# Altium schematic sheet Arduino_mini.SchDoc
size Letter; CompanyName: Carnegie Mellon University; Organization: Carnegie Mellon University; Address1: Carnegie Mellon University; Address2: Robotics Institute; Address3: 5000 Forbes Ave., 4208 NSH; Address4: Pittsburgh, PA 15213; DocumentNumber: 2; Revision: 1.0; SheetNumber: 2; SheetTotal: 8; PageSetup: Record=PageOptions|CenterHorizontal=True|CenterVertical=True|PrintScale=1.00|XCorrection=1.00|YCorrection=1.00|PrintKind=0|BorderSize=5000000|LeftOffset=0|BottomOffset=0|Orientation=2|PaperLength=1000|PaperWidth=1000|Scale=100|PaperSource=7|PrintQuality=-4|MediaType=1|DitherType=10|PaperKind=Letter|PrintScaleMode=1
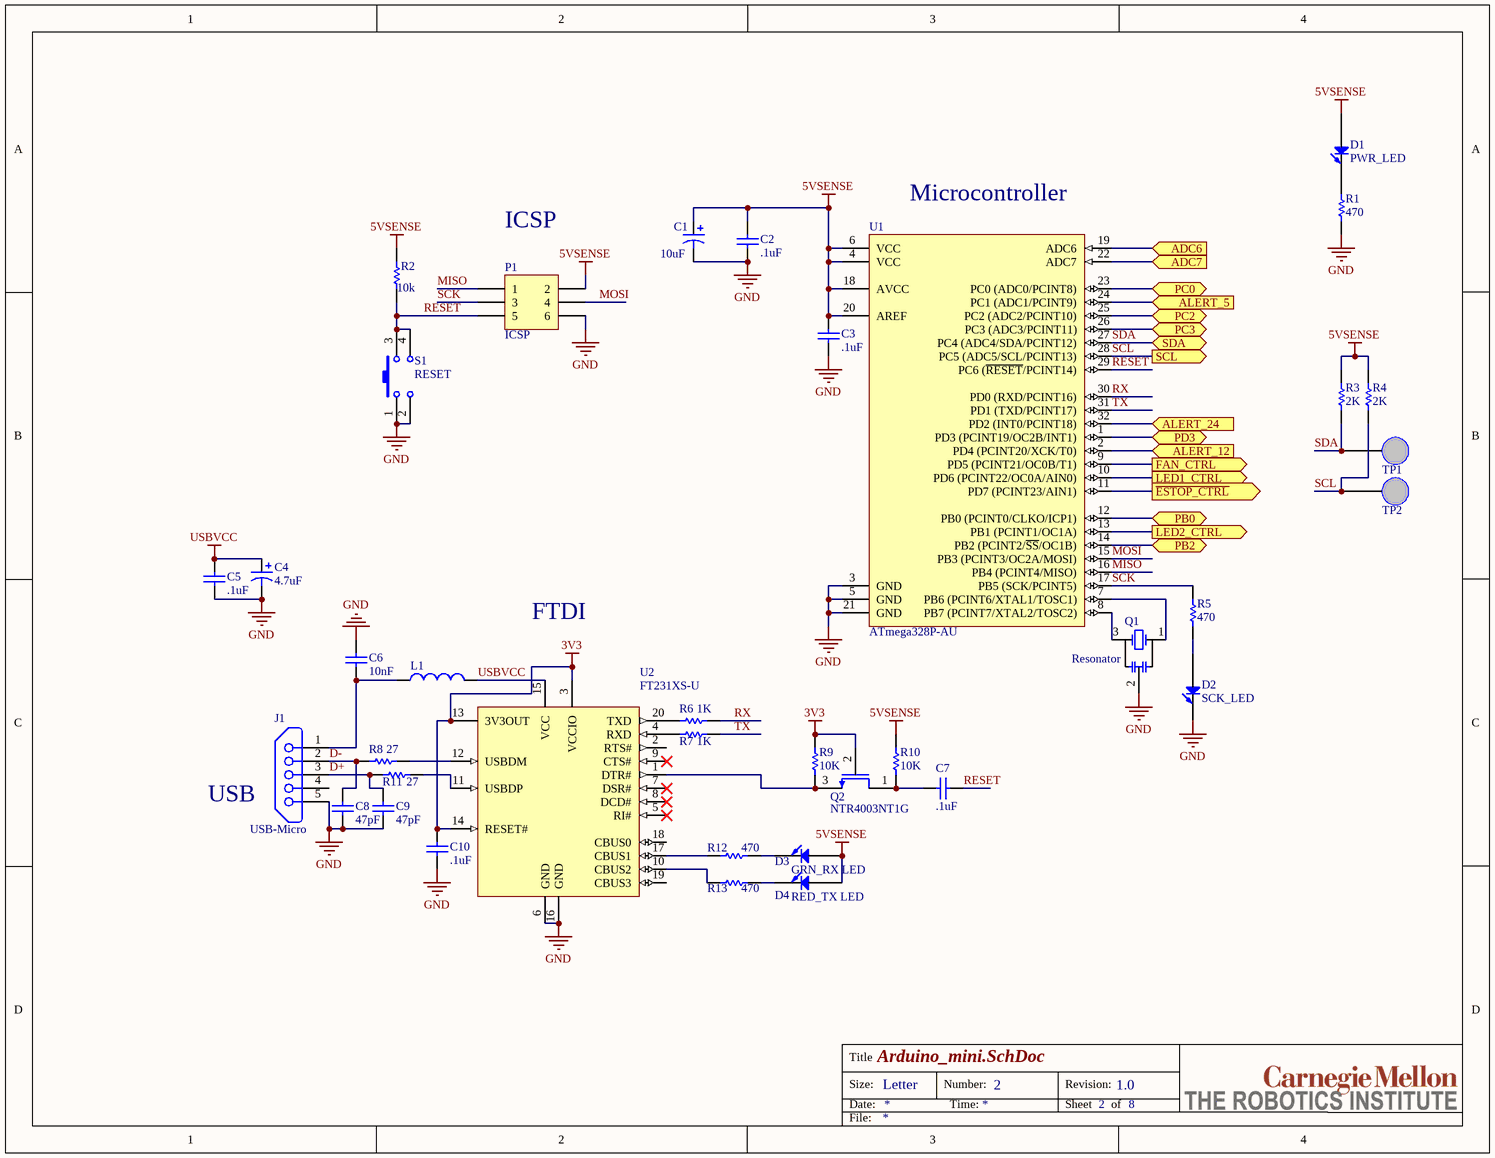
[diagram p0: Arduino_mini.SchDoc]

## Parts
C1  value 10uF  [CAPC2012N]  (hidden comment: Bypass Tantalum, 5V, 10uF)
C2  value .1uF  [CAPC1608N]  (hidden comment: Bypass, 5V, 0.1uF)
C3  value .1uF  [CAPC1608N]  (hidden comment: Bypass, 5V, .1uF)
C4  value 4.7uF  [CAPC2012N]  (hidden comment: Bypass Tantalum, USB_PWR, 4.7uF)
C5  value .1uF  [CAPC1608N]  (hidden comment: Bypass, USB_PWR, .1uF)
C6  value 10nF  [CAPC1608N]  (hidden comment: Bypass, USB_PWR, 10nF)
C7  .1uF  [CAPC1608N]
C8  47pF  [CAPC1608N]
C9  47pF  [CAPC1608N]
C10  value .1uF  [CAPC1608N]  (hidden comment: Bypass, 3V3, .1uF)
D1  PWR_LED  [0603 - LED]
D2  SCK_LED  [0603 - LED]
D3  GRN_RX LED  [0603 - LED]
D4  RED_TX LED  [0603 - LED]
J1  USB-Micro  [USB-Micro Type B]
L1  Ferrite Bead, USB_PWR  [INDC2012N]  (value not drawn)
P1  ICSP  [MHDR2X3-LOCK]
Q1  Resonator  [Resonator]
Q2  NTR4003NT1G  [SOT-23]
R1  470  [RESC1608N]
R2  10k  [RESC1608N]
R3  2K  [RESC1608N]
R4  2K  [RESC1608N]
R5  470  [RESC1608N]
R6  1K  [RESC1608N]
R7  1K  [RESC1608N]
R8  27  [RESC1608N]
R9  10K  [RESC1608N]
R10  10K  [RESC1608N]
R11  27  [RESC1608N]
R12  470  [RESC1608N]
R13  470  [RESC1608N]
S1  RESET  [PushBtn-Tiny]
TP1  SDA  [TestPoint]  (value not drawn)
TP2  SCL  [TestPoint]  (value not drawn)
U1  ATmega328P-AU  [32A_M]
U2  FT231XS-U  [SSOP-20_N]

## Ports
ADC6 (in), ADC7 (in), ALERT_5 (in), ALERT_12 (in), ALERT_24 (in), FAN_CTRL (out), LED1_CTRL (out), LED2_CTRL (out), PB0 (bidir), PB2 (bidir), PC0 (bidir), PC2 (bidir), PC3 (bidir), PD3 (bidir), SCL (out), SDA (bidir), ~{ESTOP_CTRL} (out)

## Nets
3V3: C10.2 Q2.2 R9.2 U2.3(VCCIO) U2.13(3V3OUT) U2.14(RESET#)
5VSENSE: C1.1 C2.1 C3.1 D1.2(A) D3.2(A) D4.2(A) P1.2 R2.2 R3.2 R4.2 R10.2 U1.4(VCC) U1.6(VCC) U1.18(AVCC) U1.20(AREF)
GND: C1.2 C2.2 C3.2 C4.2 C5.2 C6.2 C8.1 C9.1 C10.1 D2.1(K) J1.5(GND) P1.6 Q1.2(GND) R1.1 S1.1 S1.2 U1.3(GND) U1.5(GND) U1.21(GND) U2.6(GND) U2.16(GND)
USBVCC: C4.1 C5.1 L1.2 U2.15(VCC)
ADC6: U1.19(ADC6) ; port ADC6
ADC7: U1.22(ADC7) ; port ADC7
ALERT_5: U1.24(PC1_(ADC1/PCINT9)) ; port ALERT_5
ALERT_12: U1.2(PD4_(PCINT20/XCK/T0)) ; port ALERT_12
ALERT_24: U1.32(PD2_(INT0/PCINT18)) ; port ALERT_24
D+: C9.2 J1.3(D+) R11.2
D-: C8.2 J1.2(D-) R8.2
~{ESTOP_CTRL}: U1.11(PD7_(PCINT23/AIN1)) ; port ~{ESTOP_CTRL}
FAN_CTRL: U1.9(PD5_(PCINT21/OC0B/T1)) ; port FAN_CTRL
LED1_CTRL: U1.10(PD6_(PCINT22/OC0A/AIN0)) ; port LED1_CTRL
LED2_CTRL: U1.13(PB1_(PCINT1/OC1A)) ; port LED2_CTRL
MISO: P1.1 U1.16(PB4_(PCINT4/MISO))
MOSI: P1.4 U1.15(PB3_(PCINT3/OC2A/MOSI))
PB0: U1.12(PB0_(PCINT0/CLKO/ICP1)) ; port PB0
PB2: U1.14(PB2_(PCINT2/~{SS}/OC1B)) ; port PB2
PC0: U1.23(PC0_(ADC0/PCINT8)) ; port PC0
PC2: U1.25(PC2_(ADC2/PCINT10)) ; port PC2
PC3: U1.26(PC3_(ADC3/PCINT11)) ; port PC3
PD3: U1.1(PD3_(PCINT19/OC2B/INT1)) ; port PD3
RESET: C7.2 P1.5 R2.1 S1.3 S1.4 U1.29(PC6_(~{RESET}/PCINT14))
RX: R6.1 U1.30(PD0_(RXD/PCINT16))
SCK: P1.3 R5.2 U1.17(PB5_(SCK/PCINT5))
SCL: R4.1 TP2.1 U1.28(PC5_(ADC5/SCL/PCINT13)) ; port SCL
SDA: R3.1 TP1.1 U1.27(PC4_(ADC4/SDA/PCINT12)) ; port SDA
TX: R7.1 U1.31(PD1_(TXD/PCINT17))
NetC6_1: C6.1 J1.1(V_BUS) L1.1
NetC7_1: C7.1 Q2.1 R10.1
NetD1_1: D1.1(K) R1.2
NetD2_2: D2.2(A) R5.1
NetD3_1: D3.1(K) R12.1
NetD4_1: D4.1(K) R13.1
NetQ1_1: Q1.1(OSC1) U1.7(PB6_(PCINT6/XTAL1/TOSC1))
NetQ1_3: Q1.3(OSC2) U1.8(PB7_(PCINT7/XTAL2/TOSC2))
NetQ2_3: Q2.3 R9.1 U2.1(DTR#)
NetR6_2: R6.2 U2.20(TXD)
NetR7_2: R7.2 U2.4(RXD)
NetR8_1: R8.1 U2.12(USBDM)
NetR11_1: R11.1 U2.11(USBDP)
NetR12_2: R12.2 U2.17(CBUS1)
NetR13_2: R13.2 U2.10(CBUS2)

Not connected (* = marked no-connect by the designer): J1 4(ID); U2 2(RTS#) 5(RI#)* 7(DSR#)* 8(DCD#)* 9(CTS#)* 18(CBUS0) 19(CBUS3)

## Notes on the sheet
- ICSP
- (near U1) Microcontroller
- FTDI
- USB
- Title
- Size:
- Date:
- Letter
- Number:
- Time:
- Revision:
- Sheet
- of
- File:

## Library data of the parts
C1 = Cap Pol1: Polarized Capacitor (Radial); Manufacturer: AVX Corporation; Manufacturer Part Number: TACL106M010RTA; Manufacturer Size Code: L; Capacitance: 10µF; Tolerance: ±20%; Voltage - Rated: 10V; ESR (Equivalent Series Resistance): 7.5 Ohm; Type: Molded; Description: CAP TANT 10UF 6.3V 20% 0805; Published: 8-Jun-2000; LatestRevisionDate: 17-Jul-2002; LatestRevisionNote: Re-released for DXP Platform.; PackageReference: RB7.6-15; Publisher: Altium Limited; PackageDescription: Polarized Capacitor (Radial); 2 Leads; Supplier 1: Digi-Key; Supplier Part Number 1: 478-6230-1-ND; RoHS: RoHS Compliant; Category: Capacitors; Stock 1: 13074; Pricing 1: 1=2.24, 10=1.836, 100=1.2983, 250=1.07448, 500=0.96256, 1000=0.8954 (USD); Packaging: Cut Tape (CT); Operating Temperature: -55°C ~ 125°C; Mounting Type: Surface Mount; Package / Case: 0603 (1608 Metric); Size / Dimension: 0.063" L x 0.033" W (1.60mm x 0.85mm); Height - Seated (Max): 0.039" (1.00mm); Lead Spacing: -; Features: General Purpose; Lifetime @ Temp.: -; ComponentLink1URL: http://datasheets.avx.com/TAC.pdf; ComponentLink1Description: http://datasheets.avx.com/TAC.pdf; Supplier 2: Digi-Key; Supplier Part Number 2: 478-8115-1-ND; Stock 2: 38138; Pricing 2: 1=0.37, 10=0.312, 100=0.156, 250=0.117, 500=0.10336, 1000=0.09165 (USD); ComponentLink2URL: http://datasheets.avx.com/f92.pdf; ComponentLink2Description: http://datasheets.avx.com/f92.pdf
C2 C3 C5 C7 C10 = Cap Semi: Capacitor (Semiconductor SIM Model); Manufacturer: Murata Electronics North America; Manufacturer Part Number: GRM188R71C104KA01D; Capacitance: 0.1µF; Tolerance: ±10%; Voltage - Rated: 16V; Temperature Coefficient: X7R; Description: CAP CER 0.1UF 50V X7R 0603; Published: 8-Jun-2000; LatestRevisionDate: 29-May-2009; LatestRevisionNote: IPC-7351 Footprint Added.; PackageReference: C1206; Publisher: Altium Limited; PackageDescription: Chip Capacitor; Supplier 1: Digi-Key; Supplier Part Number 1: 490-1532-1-ND; RoHS: RoHS Compliant; Category: Capacitors; Stock 1: 4374431; Pricing 1: 1=0.1, 10=0.019, 50=0.0102, 100=0.0086, 250=0.00704, 500=0.006, 1000=0.00468 (USD); Packaging: Cut Tape (CT); Mounting Type: Surface Mount, MLCC; Operating Temperature: -55°C ~ 125°C; Applications: General Purpose; Ratings: -; Package / Case: 0603 (1608 Metric); Size / Dimension: 0.063" L x 0.031" W (1.60mm x 0.80mm); Height - Seated (Max): -; Thickness (Max): 0.035" (0.90mm); Lead Spacing: -; Features: -; Lead Style: -; ComponentLink1URL: http://www.murata.com/~/media/webrenewal/support/library/catalog/products/capacitor/mlcc/c02e.ashx; ComponentLink1Description: http://www.murata.com/~/media/webrenewal/support/library/catalog/products/capacitor/mlcc/c02e.ashx; Supplier 2: Digi-Key; Supplier Part Number 2: 490-13406-1-ND; Stock 2: 7465; Pricing 2: 1=0.11, 10=0.078, 50=0.0422, 100=0.0358, 250=0.02924, 500=0.02502, 1000=0.0195 (USD); ComponentLink2URL: http://www.murata.com/~/media/webrenewal/support/library/catalog/products/capacitor/mlcc/c02e.pdf; ComponentLink2Description: http://www.murata.com/~/media/webrenewal/support/library/catalog/products/capacitor/mlcc/c02e.pdf
  C7: Value: .1uF
C4 = Cap Pol1: Polarized Capacitor (Radial); Manufacturer: AVX Corporation; Manufacturer Part Number: TACL106M010RTA; Manufacturer Size Code: L; Capacitance: 10µF; Tolerance: ±20%; Voltage - Rated: 10V; ESR (Equivalent Series Resistance): 7.5 Ohm; Type: Molded; Description: CAP TANT 4.7UF 6.3V 20% 0805; Published: 8-Jun-2000; LatestRevisionDate: 17-Jul-2002; LatestRevisionNote: Re-released for DXP Platform.; PackageReference: RB7.6-15; Publisher: Altium Limited; PackageDescription: Polarized Capacitor (Radial); 2 Leads; Supplier 1: Digi-Key; Supplier Part Number 1: 478-6230-1-ND; RoHS: RoHS Compliant; Category: Capacitors; Stock 1: 13074; Pricing 1: 1=2.24, 10=1.836, 100=1.2983, 250=1.07448, 500=0.96256, 1000=0.8954 (USD); Packaging: Cut Tape (CT); Operating Temperature: -55°C ~ 125°C; Mounting Type: Surface Mount; Package / Case: 0603 (1608 Metric); Size / Dimension: 0.063" L x 0.033" W (1.60mm x 0.85mm); Height - Seated (Max): 0.039" (1.00mm); Lead Spacing: -; Features: General Purpose; Lifetime @ Temp.: -; ComponentLink1URL: http://datasheets.avx.com/TAC.pdf; ComponentLink1Description: http://datasheets.avx.com/TAC.pdf; Supplier 2: Digi-Key; Supplier Part Number 2: 478-8120-1-ND; Stock 2: 11892; Pricing 2: 1=0.32, 10=0.284, 100=0.1418, 250=0.1134, 500=0.10328, 1000=0.09315 (USD); ComponentLink2URL: http://datasheets.avx.com/f92.pdf; ComponentLink2Description: http://datasheets.avx.com/f92.pdf
C6 = Cap Semi: Capacitor (Semiconductor SIM Model); Manufacturer: Murata Electronics North America; Manufacturer Part Number: GRM188R71C104KA01D; Capacitance: 0.1µF; Tolerance: ±10%; Voltage - Rated: 16V; Temperature Coefficient: X7R; Description: CAP CER 10000PF 50V X7R 0603; Published: 8-Jun-2000; LatestRevisionDate: 29-May-2009; LatestRevisionNote: IPC-7351 Footprint Added.; PackageReference: C1206; Publisher: Altium Limited; PackageDescription: Chip Capacitor; Supplier 1: Digi-Key; Supplier Part Number 1: 490-1532-1-ND; RoHS: RoHS Compliant; Category: Capacitors; Stock 1: 4374431; Pricing 1: 1=0.1, 10=0.019, 50=0.0102, 100=0.0086, 250=0.00704, 500=0.006, 1000=0.00468 (USD); Packaging: Cut Tape (CT); Mounting Type: Surface Mount, MLCC; Operating Temperature: -55°C ~ 125°C; Applications: General Purpose; Ratings: -; Package / Case: 0603 (1608 Metric); Size / Dimension: 0.063" L x 0.031" W (1.60mm x 0.80mm); Height - Seated (Max): -; Thickness (Max): 0.035" (0.90mm); Lead Spacing: -; Features: -; Lead Style: -; ComponentLink1URL: http://www.murata.com/~/media/webrenewal/support/library/catalog/products/capacitor/mlcc/c02e.ashx; ComponentLink1Description: http://www.murata.com/~/media/webrenewal/support/library/catalog/products/capacitor/mlcc/c02e.ashx; Supplier 2: Digi-Key; Supplier Part Number 2: 490-1512-1-ND; Stock 2: 1780213; Pricing 2: 1=0.1, 10=0.019, 50=0.01, 100=0.0085, 250=0.00696, 500=0.00596, 1000=0.00465 (USD); ComponentLink2URL: http://www.murata.com/~/media/webrenewal/support/library/catalog/products/capacitor/mlcc/c02e.pdf; ComponentLink2Description: http://www.murata.com/~/media/webrenewal/support/library/catalog/products/capacitor/mlcc/c02e.pdf
C8 C9 = Cap Semi: Capacitor (Semiconductor SIM Model); Manufacturer: Murata Electronics North America; Manufacturer Part Number: GRM188R71C104KA01D; Capacitance: 0.1µF; Tolerance: ±10%; Voltage - Rated: 16V; Temperature Coefficient: X7R; Description: CAP CER 47PF 50V NP0 0603; Published: 8-Jun-2000; LatestRevisionDate: 29-May-2009; LatestRevisionNote: IPC-7351 Footprint Added.; PackageReference: C1206; Publisher: Altium Limited; PackageDescription: Chip Capacitor; Value: 47pF; Supplier 1: Digi-Key; Supplier Part Number 1: 490-1532-1-ND; RoHS: RoHS Compliant; Category: Capacitors; Stock 1: 4374431; Pricing 1: 1=0.1, 10=0.019, 50=0.0102, 100=0.0086, 250=0.00704, 500=0.006, 1000=0.00468 (USD); Packaging: Cut Tape (CT); Mounting Type: Surface Mount, MLCC; Operating Temperature: -55°C ~ 125°C; Applications: General Purpose; Ratings: -; Package / Case: 0603 (1608 Metric); Size / Dimension: 0.063" L x 0.031" W (1.60mm x 0.80mm); Height - Seated (Max): -; Thickness (Max): 0.035" (0.90mm); Lead Spacing: -; Features: -; Lead Style: -; ComponentLink1URL: http://www.murata.com/~/media/webrenewal/support/library/catalog/products/capacitor/mlcc/c02e.ashx; ComponentLink1Description: http://www.murata.com/~/media/webrenewal/support/library/catalog/products/capacitor/mlcc/c02e.ashx; Supplier 2: Digi-Key; Supplier Part Number 2: 1276-1037-1-ND; Stock 2: 267726; Pricing 2: 1=0.1, 10=0.027, 25=0.0192, 50=0.0148, 100=0.0125, 500=0.00878, 1000=0.00684 (USD); ComponentLink2URL: http://www.samsungsem.com/kr/support/product-search/mlcc/CL10C470JB8NNNC.jsp; ComponentLink2Description: http://www.samsungsem.com/kr/support/product-search/mlcc/CL10C470JB8NNNC.jsp
D1 = LED0: Green LED; Manufacturer: Lite-On Inc.; Manufacturer Part Number: LTST-C191TGKT; Lens Color: Colorless; Lens Transparency: Clear; Millicandela Rating: 260.5mcd; Lens Style/Size: Rectangle with Flat Top, 1.10mm x 0.80mm; Voltage - Forward (Vf) (Typ): 3.2V; Current - Test: 20mA; Viewing Angle: 130°; Wavelength - Dominant: 525nm; Wavelength - Peak: 530nm; Description: LED YELLOW CLEAR 0603 SMD; Supplier 1: Digi-Key; Supplier Part Number 1: 160-1888-1-ND; RoHS: RoHS Compliant; Category: Optoelectronics; Stock 1: 25596; Pricing 1: 1=0.57, 10=0.436, 100=0.2828, 250=0.2424, 500=0.21008, 1000=0.1616, 2500=0.14544 (USD); Packaging: Cut Tape (CT); Color: Green; Mounting Type: Surface Mount; Features: -; Package / Case: 0603 (1608 Metric); Supplier Device Package: *; Size / Dimension: 1.60mm L x 0.80mm W; Height (Max): 0.55mm; ComponentLink1URL: http://optoelectronics.liteon.com/upload/download/DS22-2000-300/S_110_LTST-C191TGKT.pdf; ComponentLink1Description: http://optoelectronics.liteon.com/upload/download/DS22-2000-300/S_110_LTST-C191TGKT.pdf; Supplier 2: Digi-Key; Supplier Part Number 2: 160-1448-1-ND; Stock 2: 378240; Pricing 2: 1=0.31, 10=0.225, 25=0.1656, 100=0.1183, 250=0.0804, 500=0.07096, 1000=0.05558, 2500=0.0544 (USD); ComponentLink2URL: http://optoelectronics.liteon.com/upload/download/DS22-2000-224/S_110_LTST-C191KSKT.pdf; ComponentLink2Description: http://optoelectronics.liteon.com/upload/download/DS22-2000-224/S_110_LTST-C191KSKT.pdf
D2 = LED0: Green LED; Manufacturer: Lite-On Inc.; Manufacturer Part Number: LTST-C191TBKT; Color: Blue; Lens Color: Colorless; Lens Transparency: Clear; Millicandela Rating: 104mcd; Lens Style/Size: Rectangle with Flat Top, 1.10mm x 0.80mm; Voltage - Forward (Vf) (Typ): 3.3V; Current - Test: 20mA; Viewing Angle: 130°; Wavelength - Dominant: 470nm; Wavelength - Peak: 468nm; Description: LED BLUE CLEAR 0603 SMD; Supplier 1: Digi-Key; Supplier Part Number 1: 160-1647-1-ND; RoHS: RoHS Compliant; Category: Optoelectronics; Stock 1: 56077; Pricing 1: 1=0.52, 10=0.376, 25=0.2884, 100=0.1881, 250=0.13796, 500=0.11704, 1000=0.09614, 2500=0.0836 (USD); Packaging: Cut Tape (CT); Mounting Type: Surface Mount; Features: -; Package / Case: 0603 (1608 Metric); Supplier Device Package: *; Size / Dimension: 1.60mm L x 0.80mm W; Height (Max): 0.55mm; ComponentLink1URL: http://optoelectronics.liteon.com/upload/download/DS22-2000-230/S_110_LTST-C191TBKT.pdf; ComponentLink1Description: http://optoelectronics.liteon.com/upload/download/DS22-2000-230/S_110_LTST-C191TBKT.pdf
D3 = LED0: Green LED; Manufacturer: Lite-On Inc; Manufacturer Part Number: LTST-C191TGKT; Wavelength - Dominant: 525nm; Wavelength - Peak: 530nm; Millicandela Rating: 260.5mcd; Voltage - Forward (Vf) (Typ): 3.2V; Current - Test: 20mA; Viewing Angle: 130°; Lens Transparency: Clear; Lens Color: Colorless; Lens Style/Size: Rectangle with Flat Top, 1.10mm x 0.80mm; Description: LED GREEN CLEAR 0603 SMD; Published: 8-Jun-2000; LatestRevisionDate: 08-Jul-2005; LatestRevisionNote: Mech Layer 1 removed.; PackageReference: LED-0; Publisher: Altium Limited; PackageDescription: LED; 2 Leads; Supplier 1: Digi-Key; Supplier Part Number 1: 160-1888-1-ND; RoHS: RoHS Compliant; Category: Optoelectronics; Stock 1: 56679; Pricing 1: 1=0.6, 10=0.436, 25=0.3556, 100=0.2844, 250=0.23996, 500=0.20442, 1000=0.15998, 2500=0.14665 (USD); Packaging: Cut Tape (CT); Color: Green; Package / Case: 0603 (1608 Metric); Supplier Device Package: *; Size / Dimension: 1.60mm L x 0.80mm W; Height (Max): 0.55mm; Mounting Type: Surface Mount; ComponentLink1URL: http://optoelectronics.liteon.com/upload/download/DS22-2000-300/S_110_LTST-C191TGKT.pdf; ComponentLink1Description: http://optoelectronics.liteon.com/upload/download/DS22-2000-300/S_110_LTST-C191TGKT.pdf; Features: -
D4 = LED0: led; Manufacturer: Lite-On Inc; Manufacturer Part Number: LTST-C191KRKT; Color: Red; Wavelength - Dominant: 631nm; Wavelength - Peak: 639nm; Millicandela Rating: 54mcd; Voltage - Forward (Vf) (Typ): 2V; Current - Test: 20mA; Viewing Angle: 130°; Lens Transparency: Clear; Lens Color: Colorless; Lens Style/Size: Rectangle with Flat Top, 1.10mm x 0.80mm; Description: LED RED CLEAR 0603 SMD; Published: 8-Jun-2000; LatestRevisionDate: 08-Jul-2005; LatestRevisionNote: Mech Layer 1 removed.; PackageReference: LED-0; Publisher: Altium Limited; PackageDescription: LED; 2 Leads; Supplier 1: Digi-Key; Supplier Part Number 1: 160-1447-1-ND; RoHS: RoHS Compliant; Category: Optoelectronics; Stock 1: 846990; Pricing 1: 1=0.29, 10=0.211, 25=0.1556, 100=0.1111, 250=0.07556, 500=0.06666, 1000=0.05222, 2500=0.05111 (USD); Packaging: Cut Tape (CT); Package / Case: 0603 (1608 Metric); Supplier Device Package: *; Size / Dimension: 1.60mm L x 0.80mm W; Height (Max): 0.55mm; Mounting Type: Surface Mount; ComponentLink1URL: http://optoelectronics.liteon.com/upload/download/DS22-2000-223/S_110_LTST-C191KRKT.pdf; ComponentLink1Description: http://optoelectronics.liteon.com/upload/download/DS22-2000-223/S_110_LTST-C191KRKT.pdf; Features: -
J1 = USB-Micro: USB-Micro Type B; Manufacturer: Molex Inc; Manufacturer Part Number: 0675031020; PCB_Layout: Complies with Manufacturer's Recommendation.; Connector Type: USB - mini B; Number of Contacts: 5; Gender: Receptacle; Specifications: USB 2.0 OTG; Published: 30-May-2008; DatasheetVersion: rev0, Mar-2004; PackageVersion: rev0, Mar-2004; PackageReference: 5000750517; Publisher: Altium Limited; PackageDescription: USB Mini-B, Type 2, Thru-Hole; 5 Position; Vertical, Body 7.7 x 4.2 x 7.7 mm (LxWxH); ComponentLink1Description: Manufacturer Link; ComponentLink1URL: http://www.molex.com/; ComponentLink2Description: Datasheet; ComponentLink2URL: http://www.molex.com/pdm_docs/sd/5000750517_sd.pdf; RoHS: RoHS Compliant; Category: Connectors, Interconnects; Packaging: Cut Tape (CT); Mounting Type: Surface Mount, Right Angle, Horizontal; Features: Shielded; Ingress Protection: -; ComponentLink3URL: http://www.molex.com/pdm_docs/sd/675031020_sd.pdf; ComponentLink3Description: http://www.molex.com/pdm_docs/sd/675031020_sd.pdf; Supplier 1: Digi-Key; Stock 1: 108151; Pricing 1: 1=0.46, 10=0.433, 25=0.3712, 50=0.3156, 100=0.3032, 250=0.27224, 500=0.25988 (USD); ComponentLink4URL: http://portal.fciconnect.com/Comergent//fci/drawing/10118194.pdf; ComponentLink4Description: http://portal.fciconnect.com/Comergent//fci/drawing/10118194.pdf; Supplier Part Number 1: 609-4618-1-ND
L1 = Inductor: Manufacturer: Laird-Signal Integrity Products; Manufacturer Part Number: MI0805K400R-10; Code_IEC: 1005; Value: 10mH; Description: FERRITE BEAD 40 OHM 0805 1LN; Filter Type: Power Line; Number of Lines: 1; Impedance @ Frequency: 40 Ohm @ 100MHz; Current Rating (Max): 1.5A; DC Resistance (DCR) (Max): 50 mOhm; Published: 8-Jun-2000; LatestRevisionDate: 29-May-2009; LatestRevisionNote: IPC-7351 Footprint Added.; PackageReference: 0402-A; Publisher: Altium Limited; PackageDescription: Chip Inductor; Code_JEITA: 0402; Supplier 1: Digi-Key; Supplier Part Number 1: 240-2389-1-ND; RoHS: RoHS Compliant; Category: Filters; Stock 1: 126874; Pricing 1: 1=0.1, 10=0.079, 25=0.0716, 50=0.0644, 100=0.0472, 250=0.03432, 500=0.03146, 1000=0.02717 (USD); Packaging: Cut Tape (CT); Ratings: -; Operating Temperature: -40°C ~ 125°C; Package / Case: 0805 (2012 Metric); Mounting Type: Surface Mount; Height (Max): 0.043" (1.10mm); Size / Dimension: 0.079" L x 0.049" W (2.00mm x 1.25mm); ComponentLink1URL: http://cdn.lairdtech.com/home/brandworld/files/Catalog_EMI%20Filtering%20&%20RF%20Inductors.pdf; ComponentLink1Description: http://cdn.lairdtech.com/home/brandworld/files/Catalog_EMI%20Filtering%20&%20RF%20Inductors.pdf
P1 = MHDR2X3: Header, 3-Pin, Dual row; Manufacturer: Sullins Connector Solutions; Manufacturer Part Number: LPPB032CFFN-RC; Number of Positions: 6; Number of Positions Loaded: All; Pitch: 0.050" (1.27mm); Supplier 1: Digi-Key; Supplier Part Number 1: S9009E-03-ND; RoHS: RoHS Compliant; Category: Connectors, Interconnects; Stock 1: 2134; Pricing 1: 1=1.13, 10=0.942, 25=0.8724, 50=0.7852, 100=0.698, 250=0.61076, 500=0.5584, 1000=0.50605, 2500=0.4537 (USD); Packaging: Bulk; Connector Type: Header; Contact Type: Female Socket; Number of Rows: 2; Row Spacing: 0.050" (1.27mm); Mounting Type: Through Hole; Termination: Solder; Fastening Type: -; Features: -; Contact Finish: Gold; Contact Finish Thickness: Flash; Color: -; ComponentLink1URL: http://www.sullinscorp.com/drawings/87_LPPB___2CFFN-RC,_10956.pdf; ComponentLink1Description: http://www.sullinscorp.com/drawings/87_LPPB___2CFFN-RC,_10956.pdf
Q1 = Resonator: Manufacturer: Murata Electronics North America; Manufacturer Part Number: CSTCE16M0V53-R0; Frequency: 16MHz; Type: Ceramic; Frequency Stability: ±0.3%; Frequency Tolerance: ±0.5%; Capacitance: 15pF; Supplier 1: Digi-Key; Supplier Part Number 1: 490-1198-1-ND; RoHS: RoHS Compliant; Category: Crystals and Oscillators; Stock 1: 60027; Pricing 1: 1=0.48, 10=0.4, 50=0.3602, 100=0.3205, 500=0.30368, 1000=0.25637 (USD); Packaging: Cut Tape (CT); Features: Built in Capacitor; Impedance: -; Operating Temperature: -20°C ~ 80°C; Mounting Type: Surface Mount; Package / Case: 3-SMD, Non-Standard; Size / Dimension: 0.126" L x 0.051" W (3.20mm x 1.30mm); Height: 0.039" (1.00mm); ComponentLink1URL: http://www.murata.com/~/media/webrenewal/support/library/catalog/products/timingdevice/ceralock/p16e.ashx; ComponentLink1Description: http://www.murata.com/~/media/webrenewal/support/library/catalog/products/timingdevice/ceralock/p16e.ashx
Q2 = NTR4003NT1G: N-Channel MOSFET; pin to pad: 1>3 2>1 3>2; Manufacturer: ON Semiconductor; Description: MOSFET N-CH 30V 500MA SOT-23; FET Type: MOSFET N-Channel, Metal Oxide; FET Feature: Standard; Drain to Source Voltage (Vdss): 30V; Current - Continuous Drain (Id) @ 25°C: 500mA (Ta); Rds On (Max) @ Id, Vgs: 1.5 Ohm @ 10mA, 4V; Vgs(th) (Max) @ Id: 1.4V @ 250µA; Gate Charge (Qg) @ Vgs: 1.15nC @ 5V; Input Capacitance (Ciss) @ Vds: 21pF @ 5V; Power - Max: 690mW; Supplier 1: Digi-Key; Supplier Part Number 1: NTR4003NT1GOSCT-ND; Manufacturer Part Number: NTR4003NT1G; RoHS: RoHS Compliant; Category: Discrete Semiconductor Products; Stock 1: 65978; Pricing 1: 1=0.27, 10=0.223, 100=0.118, 500=0.07758, 1000=0.05286 (USD); Packaging: Cut Tape (CT); Operating Temperature: -55°C ~ 150°C (TJ); Mounting Type: Surface Mount; Package / Case: TO-236-3, SC-59, SOT-23-3; Supplier Device Package: SOT-23-3 (TO-236); ComponentLink1URL: http://www.onsemi.com/pub_link/Collateral/NTR4003N-D.PDF; ComponentLink1Description: http://www.onsemi.com/pub_link/Collateral/NTR4003N-D.PDF
R1 R5 R12 R13 = Res1: Resistor; Manufacturer: Rohm Semiconductor; Manufacturer Part Number: MCR03ERTJ471; Tolerance: ±5%; Power (Watts): 0.1W, 1/10W; Temperature Coefficient: ±200ppm/°C; Description: RES SMD 470 OHM 5% 1/10W 0603; Published: 8-Jun-2000; LatestRevisionDate: 17-Jul-2002; LatestRevisionNote: Re-released for DXP Platform.; PackageReference: AXIAL-0.3; Publisher: Altium Limited; PackageDescription: Axial Device, Thru-Hole; 2 Leads; 0.3 in Pin Spacing; Value: 470; Supplier 1: Digi-Key; Supplier Part Number 1: RHM470CGCT-ND; RoHS: RoHS Compliant; Category: Resistors; Stock 1: 86697; Pricing 1: 1=0.1, 10=0.01, 25=0.0072, 100=0.0042, 250=0.00316, 500=0.00254, 1000=0.00187 (USD); Packaging: Cut Tape (CT); Resistance (Ohms): 470; Composition: Thick Film; Features: -; Operating Temperature: -55°C ~ 155°C; Package / Case: 0603 (1608 Metric); Supplier Device Package: 0603 (1608 Metric); Size / Dimension: 0.063" L x 0.031" W (1.60mm x 0.80mm); Height: 0.022" (0.55mm); Number of Terminations: 2; ComponentLink1URL: http://rohmfs.rohm.com/en/products/databook/datasheet/passive/resistor/chip_resistor/mcr_g.pdf; ComponentLink1Description: http://rohmfs.rohm.com/en/products/databook/datasheet/passive/resistor/chip_resistor/mcr_g.pdf; Supplier 2: Digi-Key; Supplier Part Number 2: 311-470GRCT-ND; Stock 2: 674624; Pricing 2: 1=0.1, 10=0.011, 25=0.008, 100=0.0044, 250=0.00336, 500=0.0027, 1000=0.00198, 2500=0.00172 (USD); ComponentLink2URL: http://www.yageo.com/documents/recent/PYu-RC_Group_51_RoHS_L_04.pdf; ComponentLink2Description: http://www.yageo.com/documents/recent/PYu-RC_Group_51_RoHS_L_04.pdf
R2 = Res1: Resistor; Manufacturer: Yageo; Manufacturer Part Number: RC0603JR-0710KL; Tolerance: ±5%; Power (Watts): 0.1W, 1/10W; Temperature Coefficient: ±100ppm/°C; Description: RES SMD 10K OHM 5% 1/10W 0603; Published: 8-Jun-2000; LatestRevisionDate: 17-Jul-2002; LatestRevisionNote: Re-released for DXP Platform.; PackageReference: AXIAL-0.3; Publisher: Altium Limited; PackageDescription: Axial Device, Thru-Hole; 2 Leads; 0.3 in Pin Spacing; Value: 10k; Supplier 1: Digi-Key; Supplier Part Number 1: 311-10KGRCT-ND; RoHS: RoHS Compliant; Category: Resistors; Stock 1: 3577331; Pricing 1: 1=0.1, 10=0.011, 25=0.008, 100=0.0044, 250=0.00336, 500=0.0027, 1000=0.00198, 2500=0.00172 (USD); Packaging: Cut Tape (CT); Resistance (Ohms): 10k; Composition: Thick Film; Features: Moisture Resistant; Operating Temperature: -55°C ~ 155°C; Package / Case: 0603 (1608 Metric); Supplier Device Package: 0603; Size / Dimension: 0.063" L x 0.031" W (1.60mm x 0.80mm); Height: 0.022" (0.55mm); Number of Terminations: 2; ComponentLink1URL: http://www.yageo.com/NewPortal/yageodocoutput?fileName=/pdf/R-Chip/PYu-RC_Group_51_RoHS_L_3.pdf; ComponentLink1Description: http://www.yageo.com/NewPortal/yageodocoutput?fileName=/pdf/R-Chip/PYu-RC_Group_51_RoHS_L_3.pdf; ComponentLink2URL: http://www.yageo.com/documents/recent/PYu-RC_Group_51_RoHS_L_04.pdf; ComponentLink2Description: http://www.yageo.com/documents/recent/PYu-RC_Group_51_RoHS_L_04.pdf
R3 R4 = Res1: Resistor; Manufacturer: Rohm Semiconductor; Manufacturer Part Number: MCR03ERTJ471; Resistance (Ohms): 470; Tolerance: ±5%; Power (Watts): 0.1W, 1/10W; Temperature Coefficient: ±200ppm/°C; Description: RES SMD 2K OHM 5% 1/10W 0603; Published: 8-Jun-2000; LatestRevisionDate: 17-Jul-2002; LatestRevisionNote: Re-released for DXP Platform.; PackageReference: AXIAL-0.3; Publisher: Altium Limited; PackageDescription: Axial Device, Thru-Hole; 2 Leads; 0.3 in Pin Spacing; Value: 2K; Supplier 1: Digi-Key; Supplier Part Number 1: RHM470CGCT-ND; RoHS: RoHS Compliant; Category: Resistors; Stock 1: 86697; Pricing 1: 1=0.1, 10=0.01, 25=0.0072, 100=0.0042, 250=0.00316, 500=0.00254, 1000=0.00187 (USD); Packaging: Cut Tape (CT); Composition: Thick Film; Features: -; Operating Temperature: -55°C ~ 155°C; Package / Case: 0603 (1608 Metric); Supplier Device Package: 0603 (1608 Metric); Size / Dimension: 0.063" L x 0.031" W (1.60mm x 0.80mm); Height: 0.022" (0.55mm); Number of Terminations: 2; ComponentLink1URL: http://rohmfs.rohm.com/en/products/databook/datasheet/passive/resistor/chip_resistor/mcr_g.pdf; ComponentLink1Description: http://rohmfs.rohm.com/en/products/databook/datasheet/passive/resistor/chip_resistor/mcr_g.pdf; Supplier 2: Digi-Key; Supplier Part Number 2: 311-2.0KGRCT-ND; Stock 2: 411222; Pricing 2: 1=0.1, 10=0.011, 25=0.008, 100=0.0044, 250=0.00336, 500=0.0027, 1000=0.00198, 2500=0.00172 (USD); ComponentLink2URL: http://www.yageo.com/documents/recent/PYu-RC_Group_51_RoHS_L_04.pdf; ComponentLink2Description: http://www.yageo.com/documents/recent/PYu-RC_Group_51_RoHS_L_04.pdf
R6 R7 = Res1: Resistor; Manufacturer: Rohm Semiconductor; Manufacturer Part Number: MCR03ERTJ471; Resistance (Ohms): 470; Tolerance: ±5%; Power (Watts): 0.1W, 1/10W; Temperature Coefficient: ±200ppm/°C; Description: RES SMD 1K OHM 5% 1/10W 0603; Published: 8-Jun-2000; LatestRevisionDate: 17-Jul-2002; LatestRevisionNote: Re-released for DXP Platform.; PackageReference: AXIAL-0.3; Publisher: Altium Limited; PackageDescription: Axial Device, Thru-Hole; 2 Leads; 0.3 in Pin Spacing; Value: 1K; Supplier 1: Digi-Key; Supplier Part Number 1: RHM470CGCT-ND; RoHS: RoHS Compliant; Category: Resistors; Stock 1: 86697; Pricing 1: 1=0.1, 10=0.01, 25=0.0072, 100=0.0042, 250=0.00316, 500=0.00254, 1000=0.00187 (USD); Packaging: Cut Tape (CT); Composition: Thick Film; Features: -; Operating Temperature: -55°C ~ 155°C; Package / Case: 0603 (1608 Metric); Supplier Device Package: 0603 (1608 Metric); Size / Dimension: 0.063" L x 0.031" W (1.60mm x 0.80mm); Height: 0.022" (0.55mm); Number of Terminations: 2; ComponentLink1URL: http://rohmfs.rohm.com/en/products/databook/datasheet/passive/resistor/chip_resistor/mcr_g.pdf; ComponentLink1Description: http://rohmfs.rohm.com/en/products/databook/datasheet/passive/resistor/chip_resistor/mcr_g.pdf; Supplier 2: Digi-Key; Supplier Part Number 2: 311-1.0KGRCT-ND; Stock 2: 2226733; Pricing 2: 1=0.1, 10=0.011, 25=0.008, 100=0.0044, 250=0.00336, 500=0.0027, 1000=0.00198, 2500=0.00172 (USD); ComponentLink2URL: http://www.yageo.com/documents/recent/PYu-RC_Group_51_RoHS_L_04.pdf; ComponentLink2Description: http://www.yageo.com/documents/recent/PYu-RC_Group_51_RoHS_L_04.pdf
R8 R11 = Res1: Resistor; Manufacturer: Rohm Semiconductor; Manufacturer Part Number: MCR03ERTJ471; Resistance (Ohms): 470; Tolerance: ±5%; Power (Watts): 0.1W, 1/10W; Temperature Coefficient: ±200ppm/°C; Description: RES SMD 27 OHM 5% 1/10W 0603; Published: 8-Jun-2000; LatestRevisionDate: 17-Jul-2002; LatestRevisionNote: Re-released for DXP Platform.; PackageReference: AXIAL-0.3; Publisher: Altium Limited; PackageDescription: Axial Device, Thru-Hole; 2 Leads; 0.3 in Pin Spacing; Value: 27; Supplier 1: Digi-Key; Supplier Part Number 1: RHM470CGCT-ND; RoHS: RoHS Compliant; Category: Resistors; Stock 1: 86697; Pricing 1: 1=0.1, 10=0.01, 25=0.0072, 100=0.0042, 250=0.00316, 500=0.00254, 1000=0.00187 (USD); Packaging: Cut Tape (CT); Composition: Thick Film; Features: -; Operating Temperature: -55°C ~ 155°C; Package / Case: 0603 (1608 Metric); Supplier Device Package: 0603 (1608 Metric); Size / Dimension: 0.063" L x 0.031" W (1.60mm x 0.80mm); Height: 0.022" (0.55mm); Number of Terminations: 2; ComponentLink1URL: http://rohmfs.rohm.com/en/products/databook/datasheet/passive/resistor/chip_resistor/mcr_g.pdf; ComponentLink1Description: http://rohmfs.rohm.com/en/products/databook/datasheet/passive/resistor/chip_resistor/mcr_g.pdf; Supplier 2: Digi-Key; Supplier Part Number 2: 311-27GRCT-ND; Stock 2: 196915; Pricing 2: 1=0.1, 10=0.011, 25=0.008, 100=0.0044, 250=0.00336, 500=0.0027, 1000=0.00198, 2500=0.00172 (USD); ComponentLink2URL: http://www.yageo.com/documents/recent/PYu-RC_Group_51_RoHS_L_04.pdf; ComponentLink2Description: http://www.yageo.com/documents/recent/PYu-RC_Group_51_RoHS_L_04.pdf
R9 R10 = Res1: Resistor; Manufacturer: Rohm Semiconductor; Manufacturer Part Number: MCR03ERTJ471; Resistance (Ohms): 470; Tolerance: ±5%; Power (Watts): 0.1W, 1/10W; Temperature Coefficient: ±200ppm/°C; Description: RES SMD 10K OHM 5% 1/10W 0603; Published: 8-Jun-2000; LatestRevisionDate: 17-Jul-2002; LatestRevisionNote: Re-released for DXP Platform.; PackageReference: AXIAL-0.3; Publisher: Altium Limited; PackageDescription: Axial Device, Thru-Hole; 2 Leads; 0.3 in Pin Spacing; Value: 10K; Supplier 1: Digi-Key; Supplier Part Number 1: RHM470CGCT-ND; RoHS: RoHS Compliant; Category: Resistors; Stock 1: 86697; Pricing 1: 1=0.1, 10=0.01, 25=0.0072, 100=0.0042, 250=0.00316, 500=0.00254, 1000=0.00187 (USD); Packaging: Cut Tape (CT); Composition: Thick Film; Features: -; Operating Temperature: -55°C ~ 155°C; Package / Case: 0603 (1608 Metric); Supplier Device Package: 0603 (1608 Metric); Size / Dimension: 0.063" L x 0.031" W (1.60mm x 0.80mm); Height: 0.022" (0.55mm); Number of Terminations: 2; ComponentLink1URL: http://rohmfs.rohm.com/en/products/databook/datasheet/passive/resistor/chip_resistor/mcr_g.pdf; ComponentLink1Description: http://rohmfs.rohm.com/en/products/databook/datasheet/passive/resistor/chip_resistor/mcr_g.pdf; Supplier 2: Digi-Key; Supplier Part Number 2: 311-10KGRCT-ND; Stock 2: 3577331; Pricing 2: 1=0.1, 10=0.011, 25=0.008, 100=0.0044, 250=0.00336, 500=0.0027, 1000=0.00198, 2500=0.00172 (USD); ComponentLink2URL: http://www.yageo.com/documents/recent/PYu-RC_Group_51_RoHS_L_04.pdf; ComponentLink2Description: http://www.yageo.com/documents/recent/PYu-RC_Group_51_RoHS_L_04.pdf
S1 = SW-PB: Switch; Manufacturer: C&K Components; Manufacturer Part Number: PTS525SM15SMTR2 LFS; Description: SWITCH TACTILE SPST-NO 0.02A 15V; Circuit: SPST-NO; Switch Function: Off-Mom; Contact Rating @ Voltage: 0.02A @ 15VDC; Actuator Type: Standard; Actuator Height off PCB, from Pins: 1.50mm; Actuator Orientation: Top Actuated; Outline: 5.25mm x 5.25mm; Illumination: Non-Illuminated; Operating Force: 160gf; Actuator Material: Polyamide (PA66), Nylon 6/6; Switch Travel: 0.25mm; Mechanical Life: 1,000,000 Cycles; Published: 24-Mar-1999; LatestRevisionDate: 17-Jul-2002; LatestRevisionNote: Re-released for DXP Platform.; PackageReference: SPST-2; Publisher: Altium Limited; PackageDescription: Switch; 2 Leads; Supplier 1: Digi-Key; Supplier Part Number 1: CKN9104CT-ND; RoHS: RoHS Compliant; Category: Switches; Stock 1: 67154; Pricing 1: 1=0.41, 10=0.4, 25=0.386, 50=0.3718, 100=0.3575, 250=0.32892, 500=0.286, 1000=0.2431 (USD); Packaging: Cut Tape (CT); Mounting Type: Surface Mount; Termination Style: Gull Wing; Illumination Voltage (Nominal): -; Illumination Type, Color: -; Ingress Protection: -; Features: -; Operating Temperature: -20°C ~ 70°C; ComponentLink1URL: http://www.ck-components.com/media/1467/pts525_12feb16.pdf; ComponentLink1Description: http://www.ck-components.com/media/1467/pts525_12feb16.pdf
TP1 TP2 = Ring_Terminal: Test Point
U1 = ATmega328P-AU: 8-bit AVR Microcontroller, 32KB Flash, 1KB EEPROM, 2KB SRAM, 32-pin TQFP, Industrial Grade (-40°C to 85°C); Published: 1-Apr-2010; DatasheetVersion: revA, Jan-2010; PackageVersion: revB, Oct-2001; PackageReference: 32A; Publisher: Altium Limited; PackageDescription: 32-Lead, 7x7x1.0 mm Body, 0.8mm Lead Pitch, Thin Profile Plastic Quad Flat Package (TQFP); Supplier 1: Digi-Key; Supplier Part Number 1: ATMEGA328P-AU-ND; Supplier 2: Farnell; Supplier Part Number 2: 1715486; Supplier 3: Mouser; Supplier Part Number 3: 556-ATMEGA328P-AU; Code_JEDEC: MS-026-ABA; ComponentLink1Description: Manufacturer Link; ComponentLink1URL: http://www.atmel.com/products/avr/default.asp?; ComponentLink2Description: ATmega48A/48PA/88A/88PA/168A/168PA/328/328P Datasheet; ComponentLink2URL: http://www.atmel.com/dyn/resources/prod_documents/8271.pdf; ComponentLink3Description: ATmega48A/48PA/88A/88PA/168A/168PA/328/328P Summary; ComponentLink3URL: http://www.atmel.com/dyn/resources/prod_documents/8271S.pdf; ComponentLink4Description: Atmel.com Home; ComponentLink4URL: http://www.atmel.com
U2 = FT231XS-U: USB to Full-Handshake UART Interface Chip, UHCI/OHCI/EHCI Compatible, USB 2.0 Compatible, -40 to +85 degC, 20-Pin SSOP, Pb-Free, Tube; Manufacturer: FTDI; Description: IC USB SERIAL FULL UART 20SSOP; Function: Bridge, USB to UART; Standards: USB 2.0; Voltage - Supply: 3.3 V ~ 5 V; Current - Supply: 8mA; DatasheetVersion: ver 1.2, Feb-2013; PackageVersion: Feb-13; PackageReference: SSOP-20; PackageDescription: 20-Pin Small Outline Package, 8.6 x 3.9 mm Body, 0.635 mm Pitch; Code_JEDEC: MO-137-AD; PartNumber: FT231XS-U; ComponentLink1Description: Manufacturer URL; ComponentLink1URL: http://www.ftdichip.com/; ComponentLink2Description: Datasheet; ComponentLink2URL: http://www.ftdichip.com/Support/Documents/DataSheets/ICs/DS_FT231X.pdf; ComponentLink3Description: FT231X Product Page; ComponentLink3URL: www.ftdichip.com/Products/ICs/FT231X.html; Supplier 1: Digi-Key; Supplier Part Number 1: 768-1156-5-ND; Manufacturer Part Number: FT231XS-U; RoHS: RoHS Compliant; Category: Integrated Circuits (ICs); Stock 1: 1723; Pricing 1: 1=2.12, 25=2.05, 100=1.98, 250=1.78, 500=1.6, 1000=1.55 (USD); Packaging: Tube; Protocol: USB; Interface: UART; Operating Temperature: -40°C ~ 85°C; Package / Case: 20-SSOP (0.154", 3.90mm Width); Supplier Device Package: 20-SSOP